# EAGLE design BRD100504 (EAGLE 5.04)
REV: R1; TITLE: USB keypad
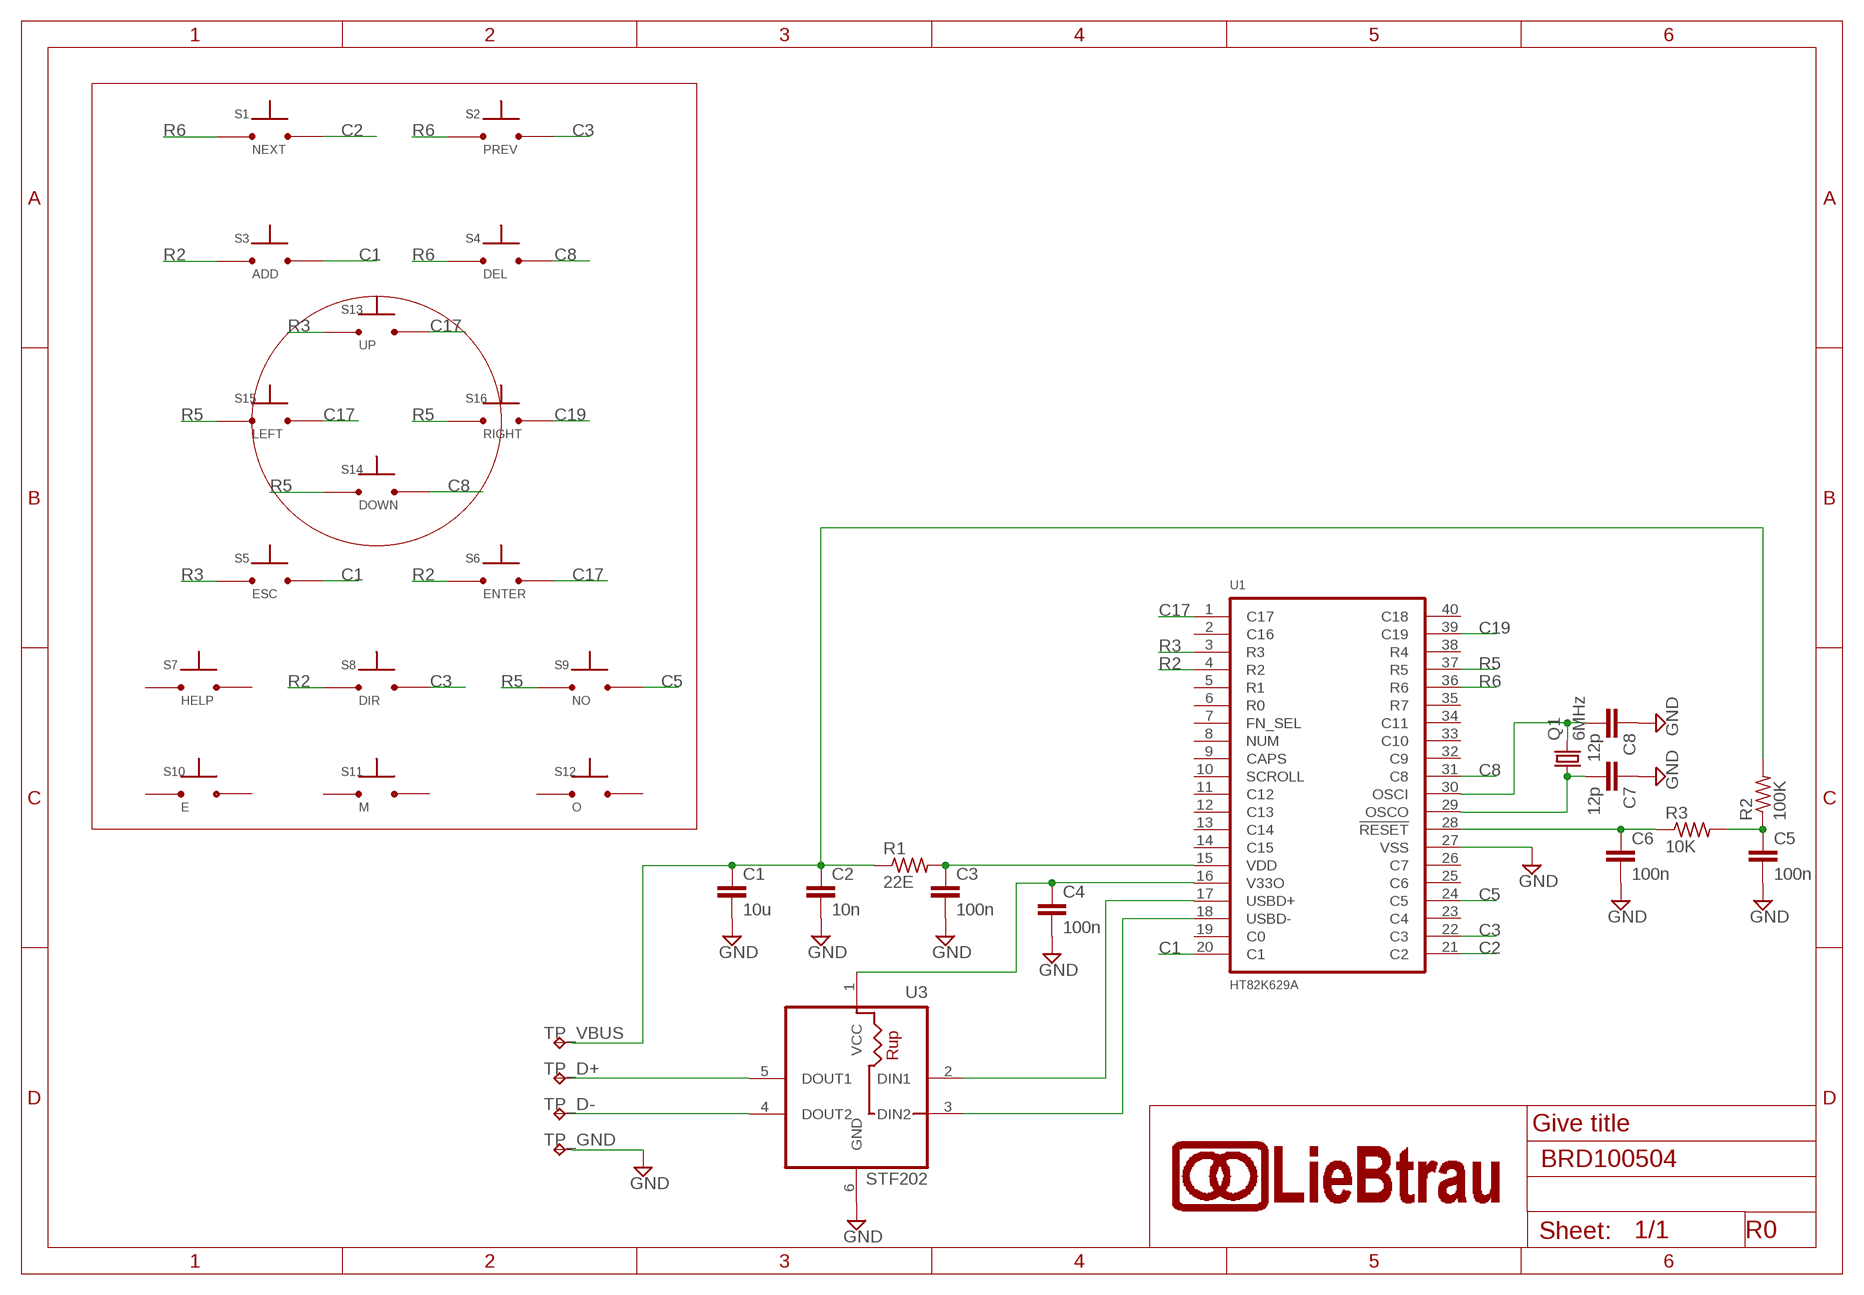
[diagram p0: schematic, sheet 1]

## Parts
C1  10u  C-EUC1206  [C1206]
C2  10n  C-EUC0805  [C0805]
C3  100n  C-EUC0805  [C0805]
C4  100n  C-EUC0805  [C0805]
C5  100n  C-EUC0805  [C0805]
C6  100n  C-EUC0805  [C0805]
C7  12p  C-EUC0603  [C0603]
C8  12p  C-EUC0603  [C0603]
Q1  6MHz  CRYSTALHC49UP  [HC49UP]
R1  22E  R-US_R0805  [R0805]
R2  100K  R-US_R0805  [R0805]
R3  10K  R-US_R0805  [R0805]
S1  NEXT  KEYB_L  [KEYB_L]
S2  PREV  KEYB_L  [KEYB_L]
S3  ADD  KEYB_L  [KEYB_L]
S4  DEL  KEYB_L  [KEYB_L]
S5  ESC  KEYB_L  [KEYB_L]
S6  ENTER  KEYB_L  [KEYB_L]
S7  HELP  KEYB_L  [KEYB_L]
S8  DIR  KEYB_L  [KEYB_L]
S9  NO  KEYB_L  [KEYB_L]
S10  E  KEYB_L  [KEYB_L]
S11  M  KEYB_L  [KEYB_L]
S12  O  KEYB_L  [KEYB_L]
S13  UP  KEYB_S  [KEYB_S]
S14  DOWN  KEYB_S  [KEYB_S]
S15  LEFT  KEYB_S  [KEYB_S]
S16  RIGHT  KEYB_S  [KEYB_S]
TP_D+  TP20R  [TP20R]
TP_D-  TP20R  [TP20R]
TP_GND  TP20R  [TP20R]
TP_VBUS  TP20R  [TP20R]
U1  HT82K629A  [DIP40X]
U3  STF202  [TSOP6]
U$3  A4  [A5L-LOC]

## Nets
C1: S3.P$2 S5.P$2 U1.20(C1)
C2: S1.P$2 U1.21(C2)
C3: S2.P$2 S8.P$2 U1.22(C3)
C5: S9.P$2 U1.24(C5)
C8: S4.P$2 S14.P$2 U1.31(C8)
C17: S6.P$2 S13.P$2 S15.P$2 U1.1(C17)
C19: S16.P$2 U1.39(C19)
GND: C1.2 C2.2 C3.2 C4.2 C5.2 C6.2 C7.1 C8.1 TP_GND.TP U1.27(VSS) U3.6(GND)
N$3: TP_D+.TP U3.5(DOUT1)
N$4: U1.18(USBD-) U3.3(DIN2)
N$5: TP_D-.TP U3.4(DOUT2)
N$7: U1.17(USBD+) U3.2(DIN1)
N$8: C5.1 R2.1 R3.2
N$10: C7.2 Q1.1 U1.29(OSCO)
N$11: C8.2 Q1.2 U1.30(OSCI)
R2: S3.P$1 S6.P$1 S8.P$1 U1.4(R2)
R3: S5.P$1 S13.P$1 U1.3(R3)
R5: S9.P$1 S14.P$1 S15.P$1 S16.P$1 U1.37(R5)
R6: S1.P$1 S2.P$1 S4.P$1 U1.36(R6)
RESET: C6.1 R3.1 U1.28(!RESET)
V33O: C4.1 U1.16(V33O) U3.1(VCC)
VBUS: C1.1 C2.1 R1.1 R2.2 TP_VBUS.TP
VDD: C3.1 R1.2 U1.15(VDD)
Unconnected: S7.P$1 S7.P$2 S10.P$1 S10.P$2 S11.P$1 S11.P$2 S12.P$1 S12.P$2 U1.2(C16) U1.5(R1) U1.6(R0) U1.7(FN_SEL) U1.8(NUM) U1.9(CAPS) U1.10(SCROLL) U1.11(C12) U1.12(C13) U1.13(C14) U1.14(C15) U1.19(C0) U1.23(C4) U1.25(C6) U1.26(C7) U1.32(C9) U1.33(C10) U1.34(C11) U1.35(R7) U1.38(R4) U1.40(C18)

## Library data of the parts
C1-C8 = rcl:C-EU: CAPACITOR, European symbol
Q1 = crystal:CRYSTAL: CRYSTAL
R1-R3 = rcl:R-US_: RESISTOR, American symbol
S1-S12 = usbkeypad:KEYB_L
S13-S16 = usbkeypad:KEYB_S
TP_D+ TP_D- TP_GND TP_VBUS = usbkeypad:TP20R
U1 = usbkeypad:HT82K629A
U3 = usbkeypad:STF202: USB Filter with ESD Protection
U$3 = usbkeypad:A4; REV: R0; TITLE: Give title

## Board
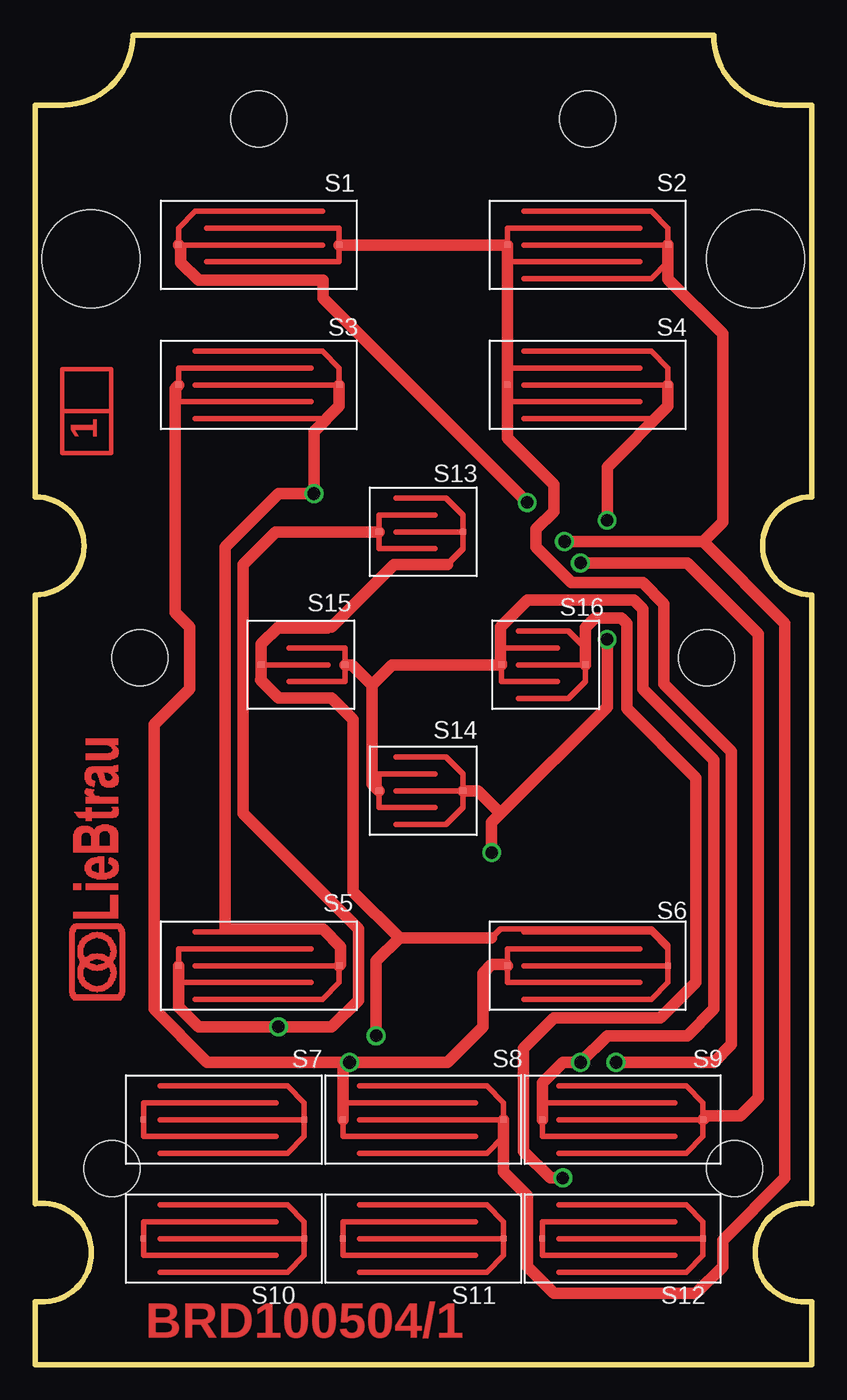
[diagram p1: board, top side]
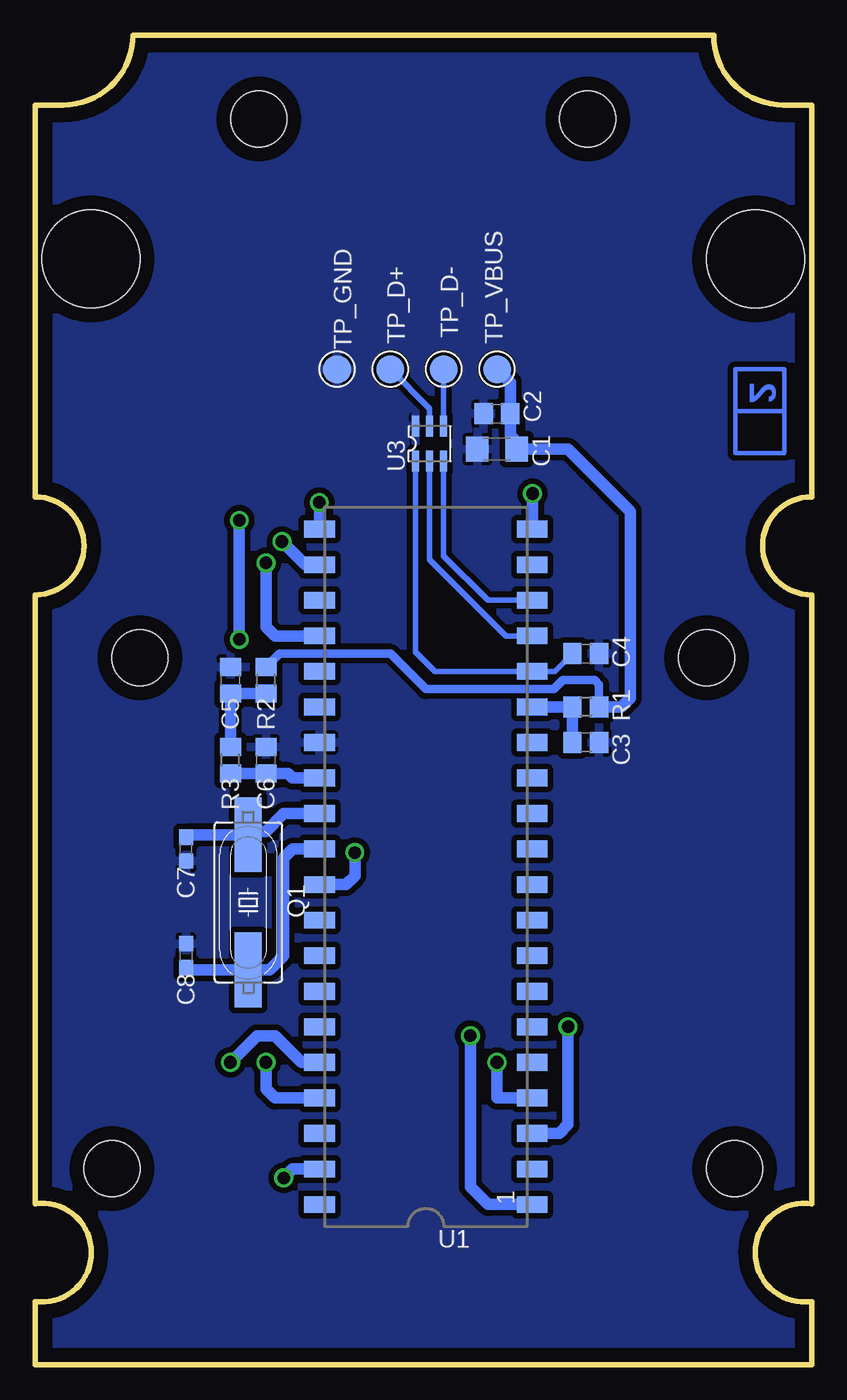
[diagram p2: board, bottom side, seen from below]

Size 55.5 x 95 mm. Coordinates in mm from the lower left corner, seen from the top.
Outline: 48.5,95 7,95 arc-90 2,90 0,90 0,62 arc-180 0,55 0,11.5 arc-196 0,4.5 0,0 55.5,0 55.5,4.5 arc-196 55.5,11.5 55.5,55 arc-180 55.5,62 55.5,90 53.5,90 arc-90 48.5,95
Copper layers (1*16): Top 0.035mm / dielectric 1.5mm / Bottom 0.035mm
Design rules "default *": minimum track width 10mil, minimum drill 24mil, track to track 8mil, track to pad 8mil, pad to pad 8mil, via to via 8mil, smd to smd 8mil, copper to edge 40mil, drill to drill 8mil, minimum pad ring 10mil, minimum via ring 8mil, stop-mask expansion 4mil, vias tented up to drill 0mil, thermal gap 10mil
Holes 4 mm at 16,89 39.5,89 7.5,50.5 48,50.5 50,14 5.5,14
Holes 7 mm at 4,79 51.5,79

### Footprints (pad centres in the part's own frame; a part is rotated, then mirrored left to right if it is on the bottom)
C1206 = smd 1.6 x 1.8: 1 -1.4,0; 2 1.4,0
C0805 = smd 1.3 x 1.5: 1 -0.95,0; 2 0.95,0
C0603 = smd 1.1 x 1: 1 -0.85,0; 2 0.85,0
HC49UP = smd 5.334 x 1.93: 1 -4.826,0; 2 4.826,0
R0805 = smd 1.3 x 1.5: 1 -0.95,0; 2 0.95,0
KEYB_L = smd 0.4 x 0.4: P$1 -5.738,0; P$2 5.738,0
KEYB_S = smd 0.4 x 0.4: P$1 -3.16,0; P$2 2.84,0
TP20R = smd 2 x 2: TP 0,0
DIP40X = smd 1.2 x 2.2: 1 -24.13,-7.6; 2 -21.59,-7.6; 3 -19.05,-7.6; 4 -16.51,-7.6; 5 -13.97,-7.6; 6 -11.43,-7.6; 7 -8.89,-7.6; 8 -6.35,-7.6; 9 -3.81,-7.6; 10 -1.27,-7.6; 11 1.27,-7.6; 12 3.81,-7.6; 13 6.35,-7.6; 14 8.89,-7.6; 15 11.43,-7.6; 16 13.97,-7.6; 17 16.51,-7.6; 18 19.05,-7.6; 19 21.59,-7.6; 20 24.13,-7.6; 21 24.13,7.6; 22 21.59,7.6; 23 19.05,7.6; 24 16.51,7.6; 25 13.97,7.6; 26 11.43,7.6; 27 8.89,7.6; 28 6.35,7.6; 29 3.81,7.6; 30 1.27,7.6; 31 -1.27,7.6; 32 -3.81,7.6; 33 -6.35,7.6; 34 -8.89,7.6; 35 -11.43,7.6; 36 -13.97,7.6; 37 -16.51,7.6; 38 -19.05,7.6; 39 -21.59,7.6; 40 -24.13,7.6
TSOP6 = smd 0.5 x 1.5: 1 -2,-1.5; 2 -1,-1.5; 3 0,-1.5; 4 0,1; 5 -1,1; 6 -2,1

### Placement (x,y rotation side)
C1  22.48,65.41 180 bottom
C2  22.48,67.94 180 bottom
C3  16.13,44.45 0 bottom
C4  16.13,50.8 0 bottom
C5  41.53,48.9 90 bottom
C6  38.99,43.18 90 bottom
C7  44.7,36.83 90 bottom
C8  44.7,29.21 270 bottom
Q1  40.26,33.02 270 bottom
R1  16.13,46.99 180 bottom
R2  38.99,48.9 90 bottom
R3  41.53,43.18 90 bottom
S1  16,80 180 top
S2  39.5,80 0 top
S3  16,70 0 top
S4  39.5,70 0 top
S5  16,28.5 0 top
S6  39.5,28.5 0 top
S7  13.5,17.5 0 top
S8  27.75,17.5 0 top
S9  42,17.5 0 top
S10  13.5,9 0 top
S11  27.75,9 0 top
S12  42,9 0 top
S13  27.75,59.5 0 top
S14  27.75,41 0 top
S15  19,50 180 top
S16  36.5,50 0 top
TP_D+  30.1,71.12 270 bottom
TP_D-  26.29,71.12 270 bottom
TP_GND  33.91,71.12 270 bottom
TP_VBUS  22.48,71.12 270 bottom
U1  27.56,35.56 90 bottom
U3  26.29,66.04 0 bottom
U$1  [LAYER_ID2]  4.7,68.58 90 top
U$2  [LIEBTRAU_PCB]  7.24,25.4 90 top
U$3  -63.88,-28.58 0 top  (outside the outline)

### Tracks (layer width: path | path; a pad name or v marks a point on that pad's centre or on a via)
C1  (via drill 0.9)
  Top 0.813: S3.P$2 21.74,68.47 19.94,66.67 v19.94,62.23 17.4,62.23 13.59,58.42 13.59,31.11 20.57,31.11 21.84,29.84 21.84,28.61 S5.P$2
  Bottom 0.813: U1.20 19.96,62.21 v19.94,62.23
C2  (via drill 0.9)
  Top 0.813: 10.25,80.01 S1.P$2 10.41,79.85 10.41,78.74 11.68,77.47 20.57,77.47 20.57,76.2 v35.18,61.59
  Bottom 0.813: U1.21 35.16,61.58 v35.18,61.59
C3  (via drill 0.9)
  Top 0.813: S2.P$2 45.25,80.01 45.25,77.56 49.15,73.66 49.15,60.2 47.75,58.8 | 47.75,58.8 v37.85,58.8 | S8.P$2 33.49,13.76 35.18,12.06 35.18,6.99 37.09,5.08 47.24,5.08 49.15,6.99 49.15,8.89 53.59,13.34 53.59,52.96 47.75,58.8
  Bottom 0.813: v37.85,58.8 36.2,57.15 U1.22
C5  (via drill 0.9)
  Top 0.813: 47.99,17.75 S9.P$2 48.02,17.78 50.42,17.78 51.69,19.05 51.69,52.2 46.61,57.28 v38.99,57.28
  Bottom 0.813: U1.24 38.35,52.07 38.99,52.71 v38.99,57.28
C8  (via drill 0.9)
  Top 0.813: v40.89,51.82 40.89,46.99 33.27,39.37 | v40.89,60.33 40.89,64.13 45.24,68.48 S4.P$2 | 33.27,39.37 32.64,38.73 v32.64,36.58 | S14.P$2 31.64,41 33.27,39.37
  Bottom 0.813: v40.89,51.82 v40.89,60.33 | v32.64,36.58 32.64,34.93 33.27,34.29 U1.31
C17  (via drill 0.9)
  Top 0.406: S6.P$2 45.24,29.95 44.07,31.11 33.27,31.11 32.64,30.48 | S13.P$2 30.59,58.27 29.46,57.15
  Top 0.813: 26.04,30.48 32.64,30.48 | 26.04,30.48 22.73,33.78 22.73,46.1 21.21,47.62 17.4,47.62 16.13,48.9 16.16,48.93 S15.P$2 16.16,51.47 17.4,52.71 21.21,52.71 25.66,57.15 29.46,57.15 | v24.38,23.49 24.38,28.83 26.04,30.48
  Bottom 0.813: v24.38,23.49 24.38,12.7 23.11,11.43 U1.1
C19  (via drill 0.9)
  Top 0.813: v37.72,13.34 36.83,13.34 34.93,15.24 34.93,22.61 37.09,24.76 44.7,24.76 47.24,27.3 47.24,41.91 42.29,46.86 42.29,52.96 41.91,53.34 40.01,53.34 39.34,52.67 S16.P$2
  Bottom 0.813: v37.72,13.34 37.09,13.97 U1.39
GND
  pour Bottom (isolate 0.406): -6.73,-6.35 59.95,-6.35 59.95,100.33 -6.73,100.33
N$3
  Bottom 0.406: U3.5 27.29,68.31 TP_D+.TP
N$4
  Bottom 0.406: U3.3 26.29,57.79 23.11,54.61 U1.18
N$5
  Bottom 0.406: U3.4 TP_D-.TP
N$7
  Bottom 0.406: U3.2 27.29,57.52 21.84,52.07 U1.17
N$8
  Bottom 0.813: R3.2 C5.1 R2.1
N$10
  Bottom 0.813: C7.2 44.54,37.85 Q1.1 40.01,38.1 38.99,38.1 37.72,39.37 U1.29
N$11
  Bottom 0.813: C8.2 44.54,28.19 Q1.2 38.74,28.19 37.72,29.21 37.72,36.2 37.09,36.83 U1.30
R2  (via drill 0.9)
  Top 0.813: v22.48,21.59 22.5,21.59 | v22.48,21.59 12.32,21.59 8.51,25.4 8.51,45.72 11.05,48.26 11.05,52.71 10.01,53.75 10.01,69.75 S3.P$1 | S8.P$1 22.01,21.59 v22.48,21.59 | v22.48,21.59 29.46,21.59 32.01,24.13 32.01,27.94 32.64,28.57 33.69,28.57 S6.P$1
  Bottom 0.813: v22.48,21.59 22.48,19.05 U1.4
R3  (via drill 0.9)
  Top 0.813: S5.P$1 10.26,25.55 11.68,24.13 v17.4,24.13 21.21,24.13 23.11,26.04 23.11,31.11 14.86,39.37 14.86,57.15 17.21,59.5 S13.P$1
  Bottom 0.813: U1.3 18.04,16.51 17.4,17.14 v17.4,24.13
R5  (via drill 0.9)
  Top 0.813: 24.09,48.57 25.52,50 S16.P$1 33.34,50.1 33.27,50.16 33.27,52.71 35.18,54.61 42.8,54.61 43.44,53.98 43.44,48.26 48.52,43.18 48.52,25.4 46.61,23.49 40.89,23.49 v38.99,21.59 37.72,21.59 36.26,20.13 S9.P$1 | 24.09,48.57 24.09,41.5 S14.P$1 | 24.09,48.57 22.66,50 S15.P$1
  Bottom 0.813: v38.99,21.59 38.99,19.68 38.35,19.05 U1.37
R6  (via drill 0.9)
  Top 0.813: S1.P$1 S2.P$1 S4.P$1 33.76,66.19 37.09,62.87 37.09,60.96 35.81,59.69 35.81,58.42 38.35,55.88 43.44,55.88 44.96,54.36 44.96,48.64 49.78,43.82 49.78,22.86 48.52,21.59 v41.53,21.59
  Bottom 0.813: U1.36 36.45,21.59 38.35,23.49 39.62,23.49 v41.53,21.59
RESET
  Bottom 0.813: R3.1 C6.1 37.41,42.23 37.09,41.91 U1.28
V33O
  Bottom 0.406: U3.1 28.29,50.9 26.93,49.53 U1.16 18.35,49.53 C4.1
  Bottom 0.61: C4.1 17.4,50.8
VBUS
  Bottom 0.61: R2.2 38.03,50.8 30.1,50.8 27.56,48.26 18.42,48.26 17.78,48.9 15.5,48.9 15.18,48.58 R1.1
  Bottom 0.813: R1.1 13.59,46.99 12.96,47.62 12.96,60.96 17.4,65.41 20.57,65.41 | 20.57,65.41 C1.1 | 20.57,65.41 21.53,66.36 C2.1 21.53,70.17 TP_VBUS.TP
VDD
  Bottom 0.813: C3.1 R1.2 U1.15

### Text on the board
Top: BRD100504/1